# Altium schematic sheet LCD_Touch.SchDoc
size 420 x 297 mm; SheetNumber: 3; SheetTotal: 4
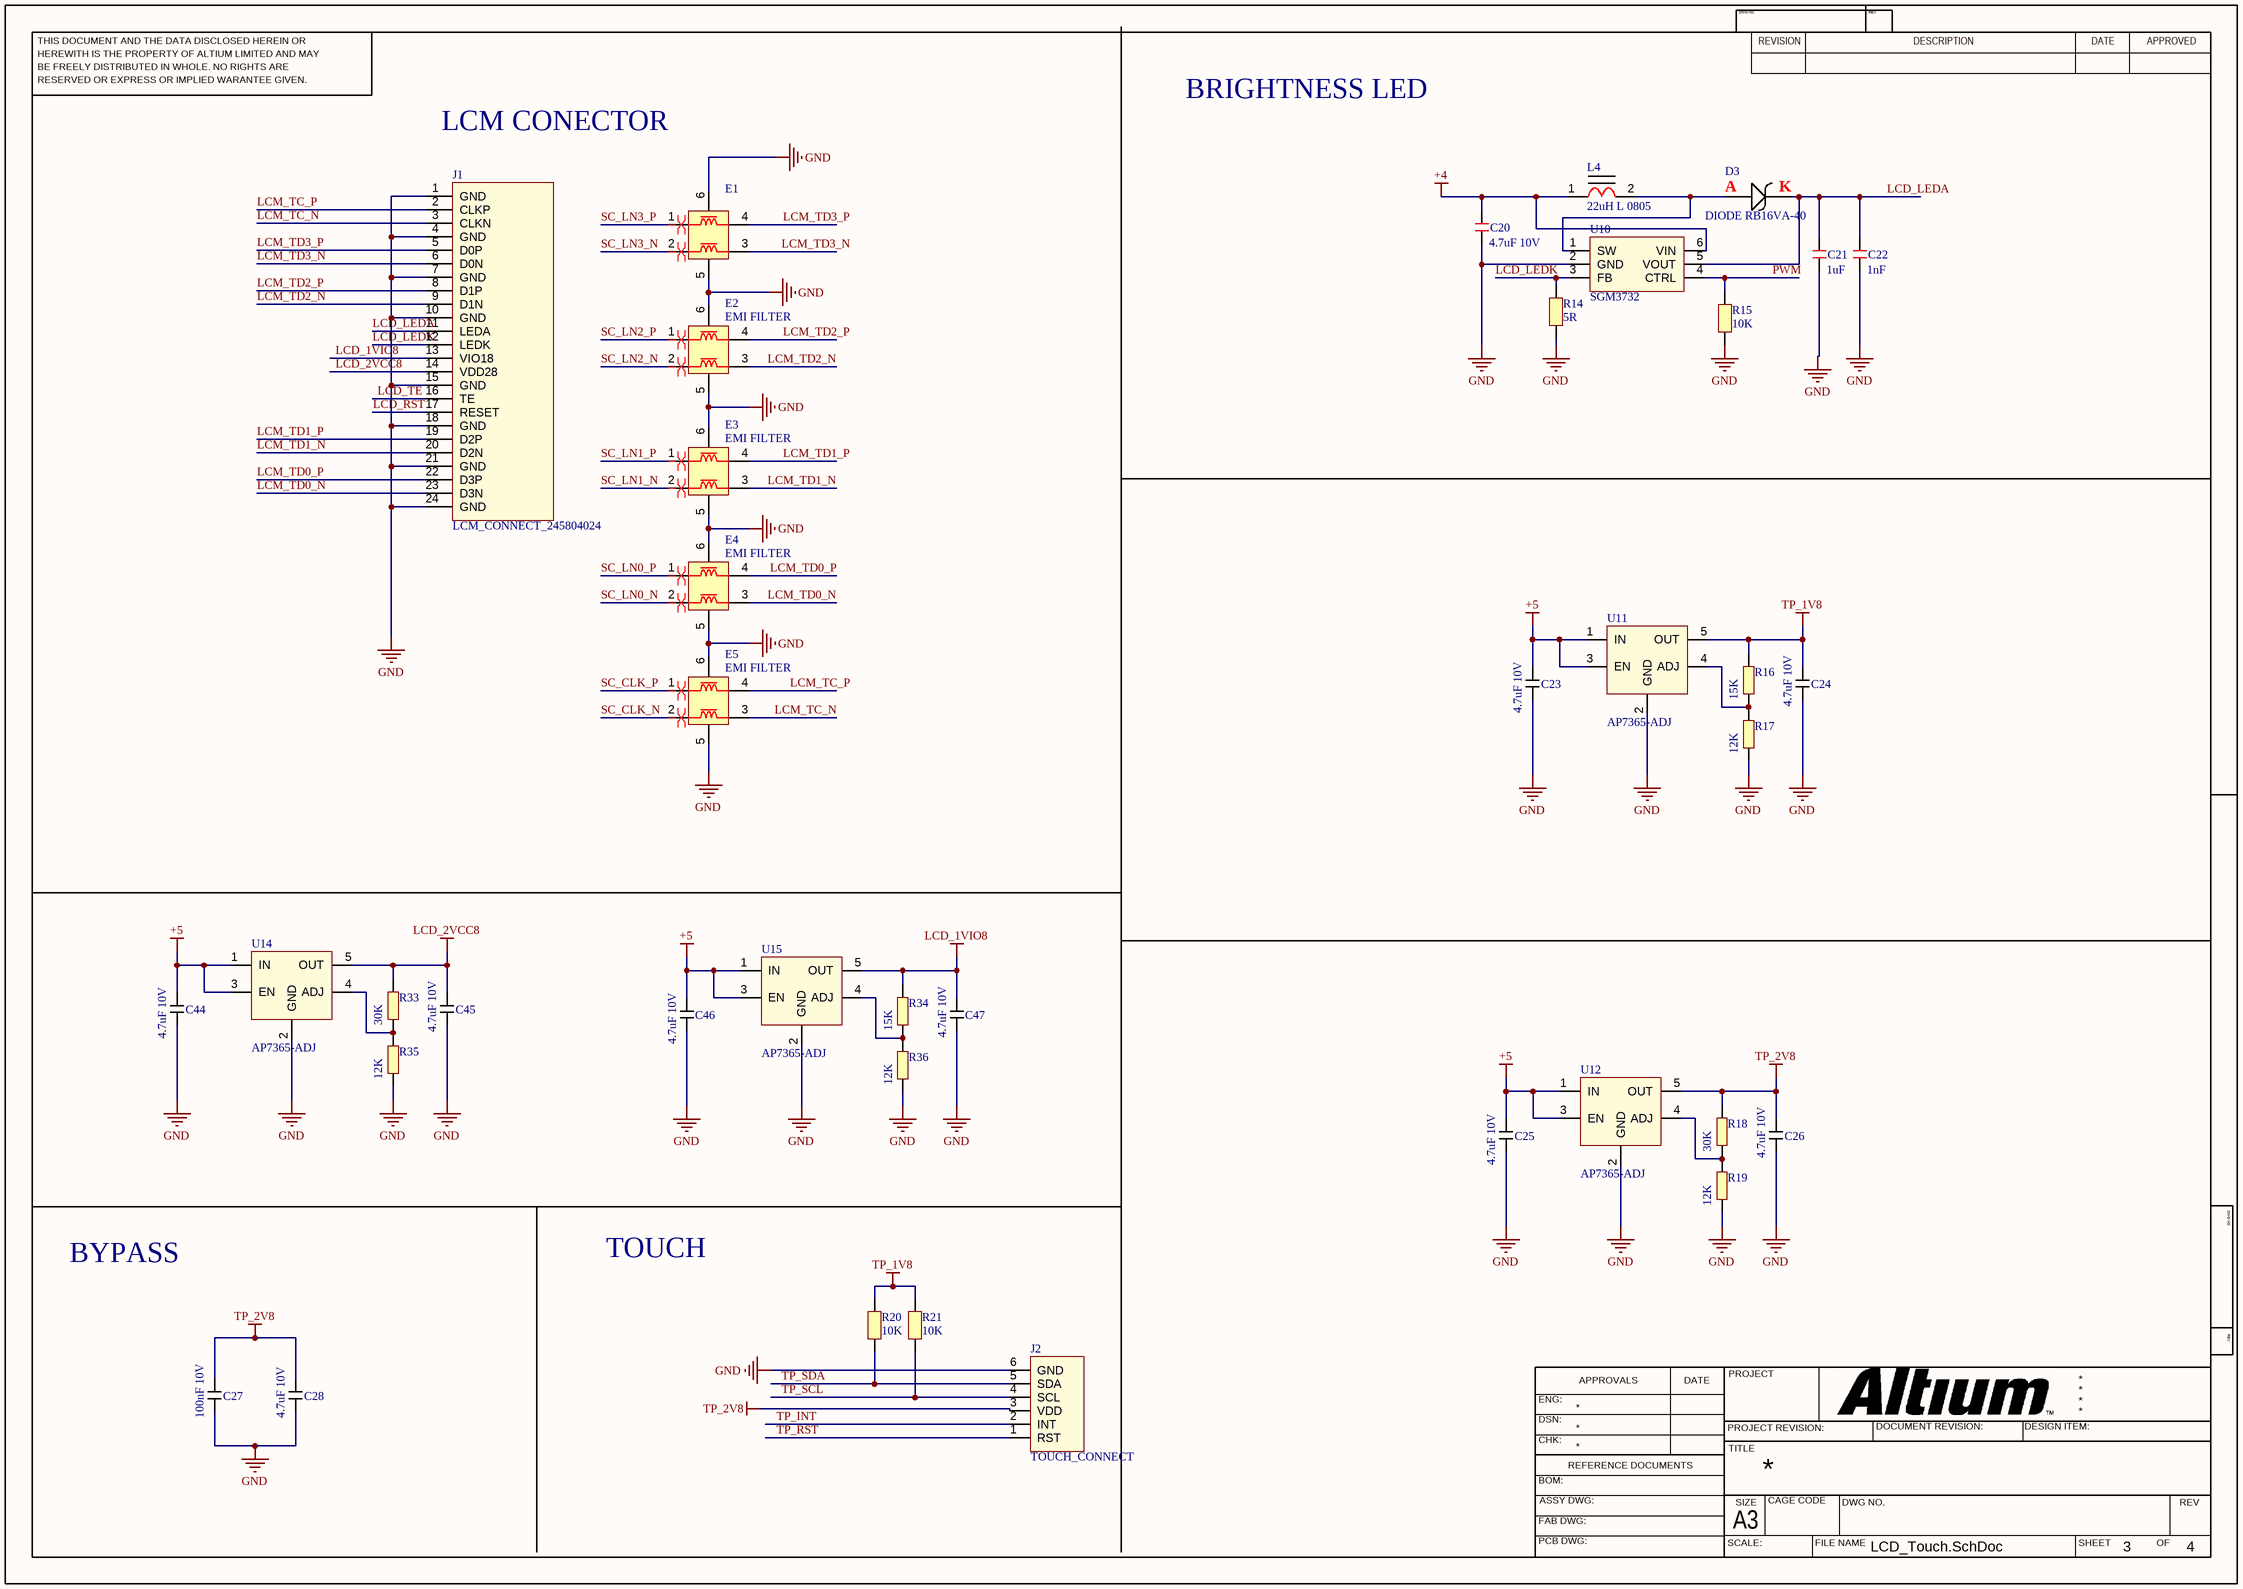
[diagram p0: LCD_Touch.SchDoc]

## Parts
C20  4.7uF 10V  [C 0805]
C21  1uF  [C 0805]
C22  1nF  [C 0805]
C23  4.7uF 10V  [c 0805]
C24  4.7uF 10V  [c 0805]
C25  4.7uF 10V  [c 0805]
C26  4.7uF 10V  [c 0805]
C27  100nF 10V  [c 0805]
C28  4.7uF 10V  [c 0805]
C44  4.7uF 10V  [c 0805]
C45  4.7uF 10V  [c 0805]
C46  4.7uF 10V  [c 0805]
C47  4.7uF 10V  [c 0805]
D3  DIODE RB16VA-40  [RB16VA-40]
E1  (no value)  [ICMEF112P900MFR]
E2  EMI FILTER  [ICMEF112P900MFR]
E3  EMI FILTER  [ICMEF112P900MFR]
E4  EMI FILTER  [ICMEF112P900MFR]
E5  EMI FILTER  [ICMEF112P900MFR]
J1  LCM_CONNECT_245804024  [A245804024]
J2  TOUCH_CONNECT  [FH34SRJ-6S-0.5SH]
L4  22uH L 0805  [Ferrite 0805]
R14  5R  [R 0805]
R15  10K  [R 0805]
R16  15K  [R 0805]
R17  12K  [R 0805]
R18  30K  [R 0805]
R19  12K  [R 0805]
R20  10K  [R 0805]
R21  10K  [R 0805]
R33  30K  [R 0805]
R34  15K  [R 0805]
R35  12K  [R 0805]
R36  12K  [R 0805]
U10  SGM3732  [SGM3732]
U11  AP7365-ADJ  [AP7365-ADJ]
U12  AP7365-ADJ  [AP7365-ADJ]
U14  AP7365-ADJ  [AP7365-ADJ]
U15  AP7365-ADJ  [AP7365-ADJ]

## Nets
+4: C20.2 L4.1 U10.6(VIN)
+5: C23.2 C25.2 C44.2 C46.2 U11.1(IN) U11.3(EN) U12.1(IN) U12.3(EN) U14.1(IN) U14.3(EN) U15.1(IN) U15.3(EN)
GND: C20.1 C21.1 C22.1 C23.1 C24.1 C25.1 C26.1 C27.1 C28.1 C44.1 C45.1 C46.1 C47.1 E1.5 E1.6 E2.5 E2.6 E3.5 E3.6 E4.5 E4.6 E5.5 E5.6 J1.1(GND) J1.4(GND) J1.7(GND) J1.10(GND) J1.15(GND) J1.18(GND) J1.21(GND) J1.24(GND) J2.6(GND) R14.1 R15.1 R17.1 R19.1 R35.1 R36.1 U10.2(GND) U11.2(GND) U12.2(GND) U14.2(GND) U15.2(GND)
LCD_1VIO8: C47.2 J1.13(VIO18) R34.2 U15.5(OUT)
LCD_2VCC8: C45.2 J1.14(VDD28) R33.2 U14.5(OUT)
TP_1V8: C24.2 R16.2 R20.2 R21.2 U11.5(OUT)
TP_2V8: C26.2 C27.2 C28.2 J2.3(VDD) R18.2 U12.5(OUT)
LCD_LEDA: C21.2 C22.2 D3.2 J1.11(LEDA) U10.5(VOUT)
LCD_LEDK: J1.12(LEDK) R14.2 U10.3(FB)
LCD_RST: J1.17(RESET)
LCD_TE: J1.16(TE)
LCM_TC_N: E5.3 J1.3(CLKN)
LCM_TC_P: E5.4 J1.2(CLKP)
LCM_TD0_N: E4.3 J1.23(D3N)
LCM_TD0_P: E4.4 J1.22(D3P)
LCM_TD1_N: E3.3 J1.20(D2N)
LCM_TD1_P: E3.4 J1.19(D2P)
LCM_TD2_N: E2.3 J1.9(D1N)
LCM_TD2_P: E2.4 J1.8(D1P)
LCM_TD3_N: E1.3 J1.6(D0N)
LCM_TD3_P: E1.4 J1.5(D0P)
PWM: R15.2 U10.4(CTRL)
SC_CLK_N: E5.2
SC_CLK_P: E5.1
SC_LN0_N: E4.2
SC_LN0_P: E4.1
SC_LN1_N: E3.2
SC_LN1_P: E3.1
SC_LN2_N: E2.2
SC_LN2_P: E2.1
SC_LN3_N: E1.2
SC_LN3_P: E1.1
TP_INT: J2.2(INT)
TP_RST: J2.1(RST)
TP_SCL: J2.4(SCL) R21.1
TP_SDA: J2.5(SDA) R20.1
NetD3_1: D3.1 L4.2 U10.1(SW)
NetR16_1: R16.1 R17.2 U11.4(ADJ)
NetR18_1: R18.1 R19.2 U12.4(ADJ)
NetR33_1: R33.1 R35.2 U14.4(ADJ)
NetR34_1: R34.1 R36.2 U15.4(ADJ)

## Layout directives
differential pair: SC_CLK_N, SC_CLK_P, SC_LN0_N, SC_LN0_P, SC_LN1_N, SC_LN1_P, SC_LN2_N, SC_LN2_P, SC_LN3_N, SC_LN3_P

## Notes on the sheet
- BRIGHTNESS LED
- LCM CONECTOR
- BYPASS
- TOUCH
- THIS DOCUMENT AND THE DATA DISCLOSED HEREIN OR
- HEREWITH IS THE PROPERTY OF ALTIUM LIMITED AND MAY
- DWG NO:
- REVISION
- REV:
- DESCRIPTION
- DATE
- APPROVED
- BE FREELY DISTRIBUTED IN WHOLE. NO RIGHTS ARE
- RESERVED OR EXPRESS OR IMPLIED WARANTEE GIVEN.
- ENG:
- APPROVALS
- PROJECT
- DSN:
- CHK:
- REFERENCE DOCUMENTS
- PROJECT REVISION:
- TITLE
- DOCUMENT REVISION:
- DESIGN ITEM:
- BOM:
- FAB DWG:
- PCB DWG:
- ASSY DWG:
- SCALE:
- A3
- SIZE
- CAGE CODE
- FILE NAME
- DWG NO.
- SHEET
- OF
- REV
- (in symbol DIODE RB16VA-40) A; K

## Library data of the parts
C20-C28 C44-C47 = C 0805
E1 = EMI FILTER
L4 = Ferite 0805
R14-R21 R33-R36 = R 0805